# Altium schematic sheet SCH_UNLOCK.SchDoc
size A4; SheetNumber: 1; SheetTotal: 1
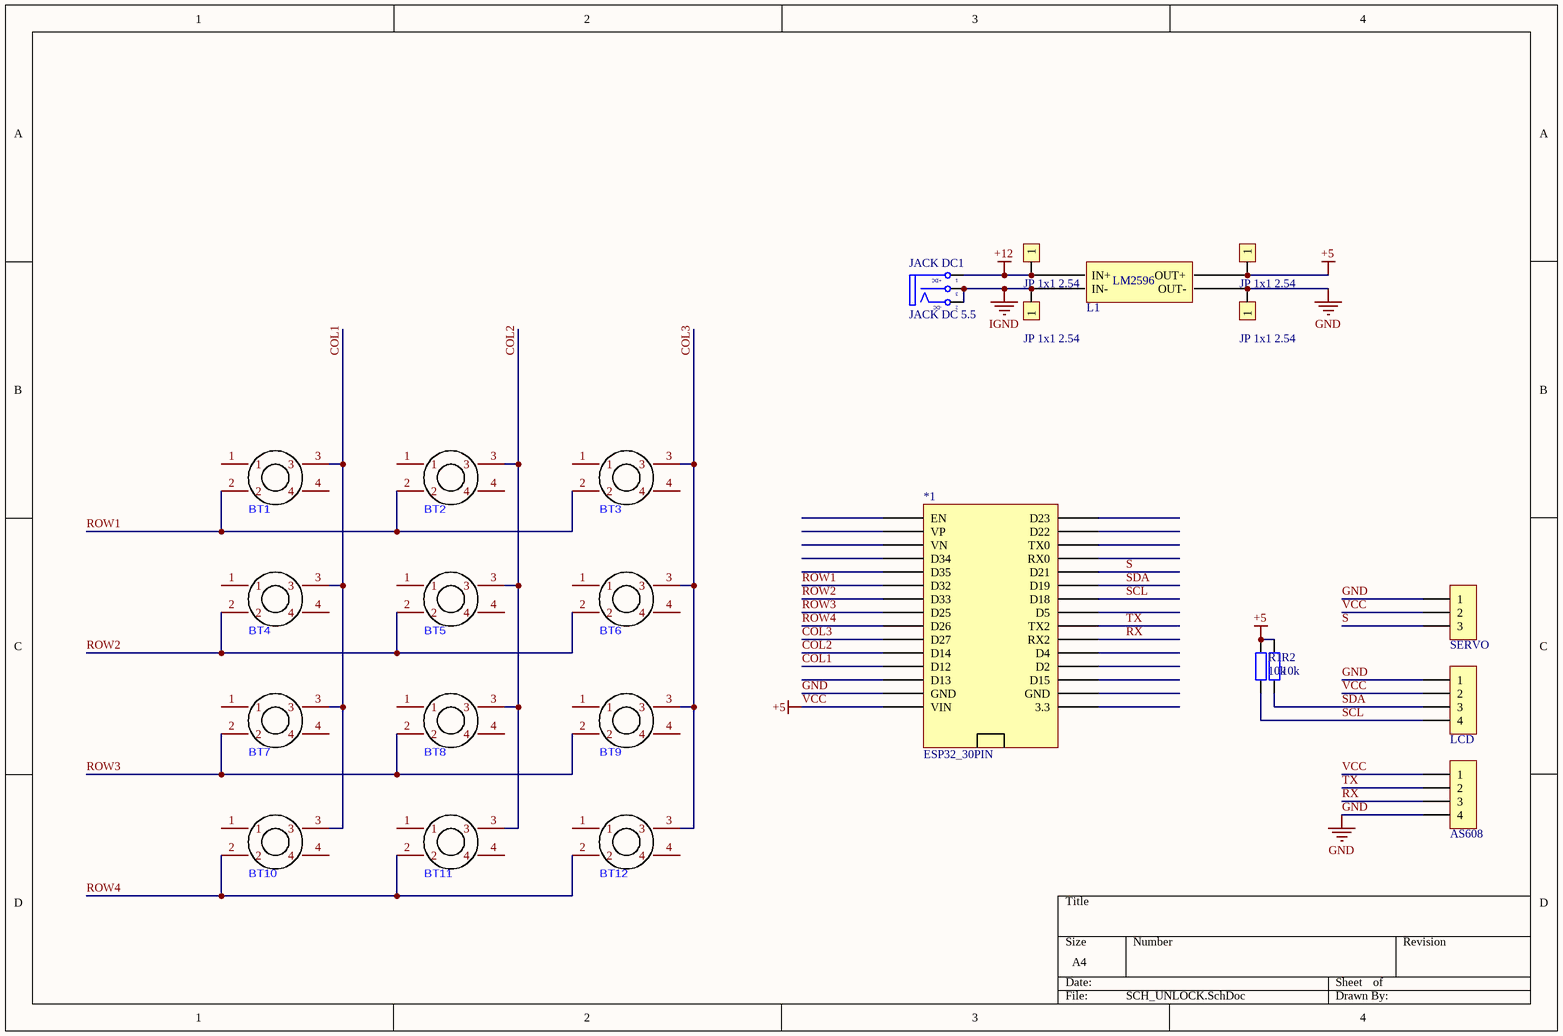
[diagram p0: SCH_UNLOCK.SchDoc]

## Parts
*1  ESP32_30PIN  [ESP32_30PIN]
BT1  Nut Nhan 4 chan 12x12  [12X12 BUTTOM Blue]  (value not drawn)
BT2  Nut Nhan 4 chan 12x12  [12X12 BUTTOM Blue]  (value not drawn)
BT3  Nut Nhan 4 chan 12x12  [12X12 BUTTOM Blue]  (value not drawn)
BT4  Nut Nhan 4 chan 12x12  [12X12 BUTTOM Blue]  (value not drawn)
BT5  Nut Nhan 4 chan 12x12  [12X12 BUTTOM Blue]  (value not drawn)
BT6  Nut Nhan 4 chan 12x12  [12X12 BUTTOM Blue]  (value not drawn)
BT7  Nut Nhan 4 chan 12x12  [12X12 BUTTOM Blue]  (value not drawn)
BT8  Nut Nhan 4 chan 12x12  [12X12 BUTTOM Blue]  (value not drawn)
BT9  Nut Nhan 4 chan 12x12  [12X12 BUTTOM Blue]  (value not drawn)
BT10  Nut Nhan 4 chan 12x12  [12X12 BUTTOM Blue]  (value not drawn)
BT11  Nut Nhan 4 chan 12x12  [12X12 BUTTOM Blue]  (value not drawn)
BT12  Nut Nhan 4 chan 12x12  [12X12 BUTTOM Blue]  (value not drawn)
H1  SERVO  [XH2.54M-3]
H2  LCD  [XH2.54M-4]
H3  AS608  [XH2.54M-4]
JACK_DC1  JACK DC 5.5  [JACK DC 5.5]
JP1  JP 1x1 2.54  [JP 1x1 DT]
JP2  JP 1x1 2.54  [JP 1x1 DT]
JP3  JP 1x1 2.54  [JP 1x1 DT]
JP4  JP 1x1 2.54  [JP 1x1 DT]
L1  BUCK_LM2596  [BUCK_LM2596]  (value not drawn)
R1  10k  [tro vach 1/4w]
R2  10k  [tro vach 1/4w]

## Nets
+12: JACK_DC1.1(T) JP1.1 L1.1(IN+)
GND: *1.GND H1.1 H2.1 H3.4 JP4.1 L1.3(OUT-)
IGND: JACK_DC1.2(TN) JACK_DC1.3(S) JP3.1 L1.2(IN-)
VCC: *1.VIN H1.2 H2.2 H3.1 JP2.1 L1.4(OUT+) R1.1 R2.1  [also labelled +5]
COL1: *1.D12 BT1.3 BT4.3 BT7.3 BT10.3
COL2: *1.D14 BT2.3 BT5.3 BT8.3 BT11.3
COL3: *1.D27 BT3.3 BT6.3 BT9.3 BT12.3
ROW1: *1.D32 BT1.2 BT2.2 BT3.2
ROW2: *1.D33 BT4.2 BT5.2 BT6.2
ROW3: *1.D25 BT7.2 BT8.2 BT9.2
ROW4: *1.D26 BT10.2 BT11.2 BT12.2
RX: *1.RX2 H3.3
S: *1.D21 H1.3
SCL: *1.D18 H2.4 R1.2
SDA: *1.D19 H2.3 R2.2
TX: *1.TX2 H3.2

Not connected (* = marked no-connect by the designer): *1 3.3 D2 D4 D5 D13 D15 D22 D23 D34 D35 EN RX0 TX0 VN VP; BT1 1 4; BT2 1 4; BT3 1 4; BT4 1 4; BT5 1 4; BT6 1 4; BT7 1 4; BT8 1 4; BT9 1 4; BT10 1 4; BT11 1 4; BT12 1 4

## Notes on the sheet
- (in symbol BUCK_LM2596) LM2596
- (in symbol JACK DC 5.5) +DC; -DC

## Library data of the parts
H1 = Header 3P 2.54 Duc Thang: Cắm; Ten_Linh_Kien: Header 3P XH2.54-3P Đực Thẳng; Don_Vi: Con; Ma_Hang: MH001292; Chung_Loai: Cắm
H2 H3 = Header 4P 2.54 Duc Thang: Cắm; Ten_Linh_Kien: Header 4P XH2.54-4P Đực Thẳng; Don_Vi: Con; Ma_Hang: MH001285; Chung_Loai: Cắm
JACK_DC1 = JACK DC 5.5: Value: Jac DC
JP1-JP4 = JP 1x1 2.54 Duc Cong: Cắm; Ten_Linh_Kien: Jump Đơn Đực 2.54MM 1x40P Cong Đứng; Don_Vi: Con; Ma_Hang: MH000904; Ghi_Chu: *; Kieu_Chan: *; Chung_Loai: Cắm
R1 R2 = Tro Vach 1/4W 5% 10k: Căm; Chung_Loai: Cắm; Don_Vi: Con; So_Chan: 2; Ten_Linh_Kien: Trở Vạch 1/4w 5% 10K; Ma_Hang: MH007354; Kieu_Chan: *